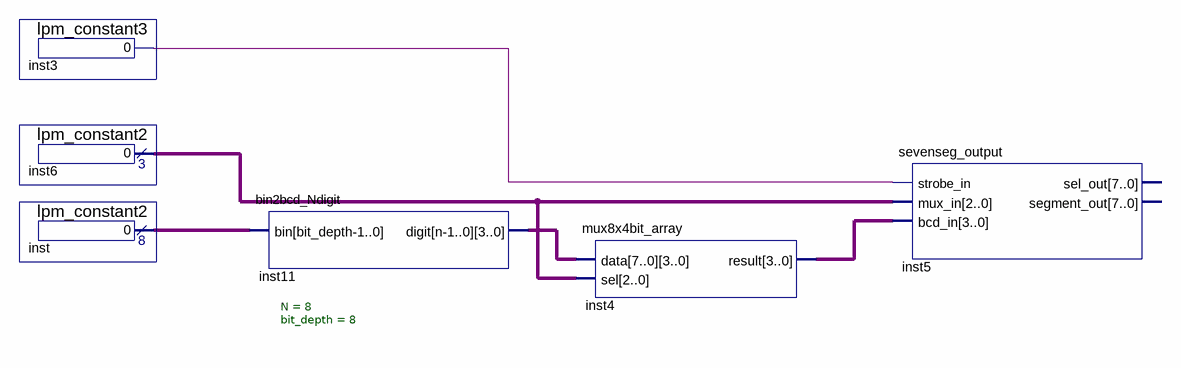
[diagram p0: schematic sheet]
// Quartus schematic TestBench.bdf as structural Verilog: 6 symbols, 0 pins
module TestBench (
);

  wire inst3_result;
  wire [2:0] inst6_result;
  wire [3:0] inst4_result;
  wire [7:0] inst_result;
  wire [31:0] inst11_digit;

  lpm_constant3 inst3 (.result(inst3_result));
  lpm_constant2 inst6 (.result(inst6_result));
  lpm_constant2 inst (.result(inst_result));
  bin2bcd_Ndigit #(.N(8), .bit_depth(8)) inst11 (.bin(inst_result), .digit(inst11_digit));
  mux8x4bit_array inst4 (.data(inst11_digit), .sel(inst6_result), .result(inst4_result));
  sevenseg_output inst5 (
    .strobe_in(inst3_result), .mux_in(inst6_result), .bcd_in(inst4_result));  // open: sel_out, segment_out
endmodule
